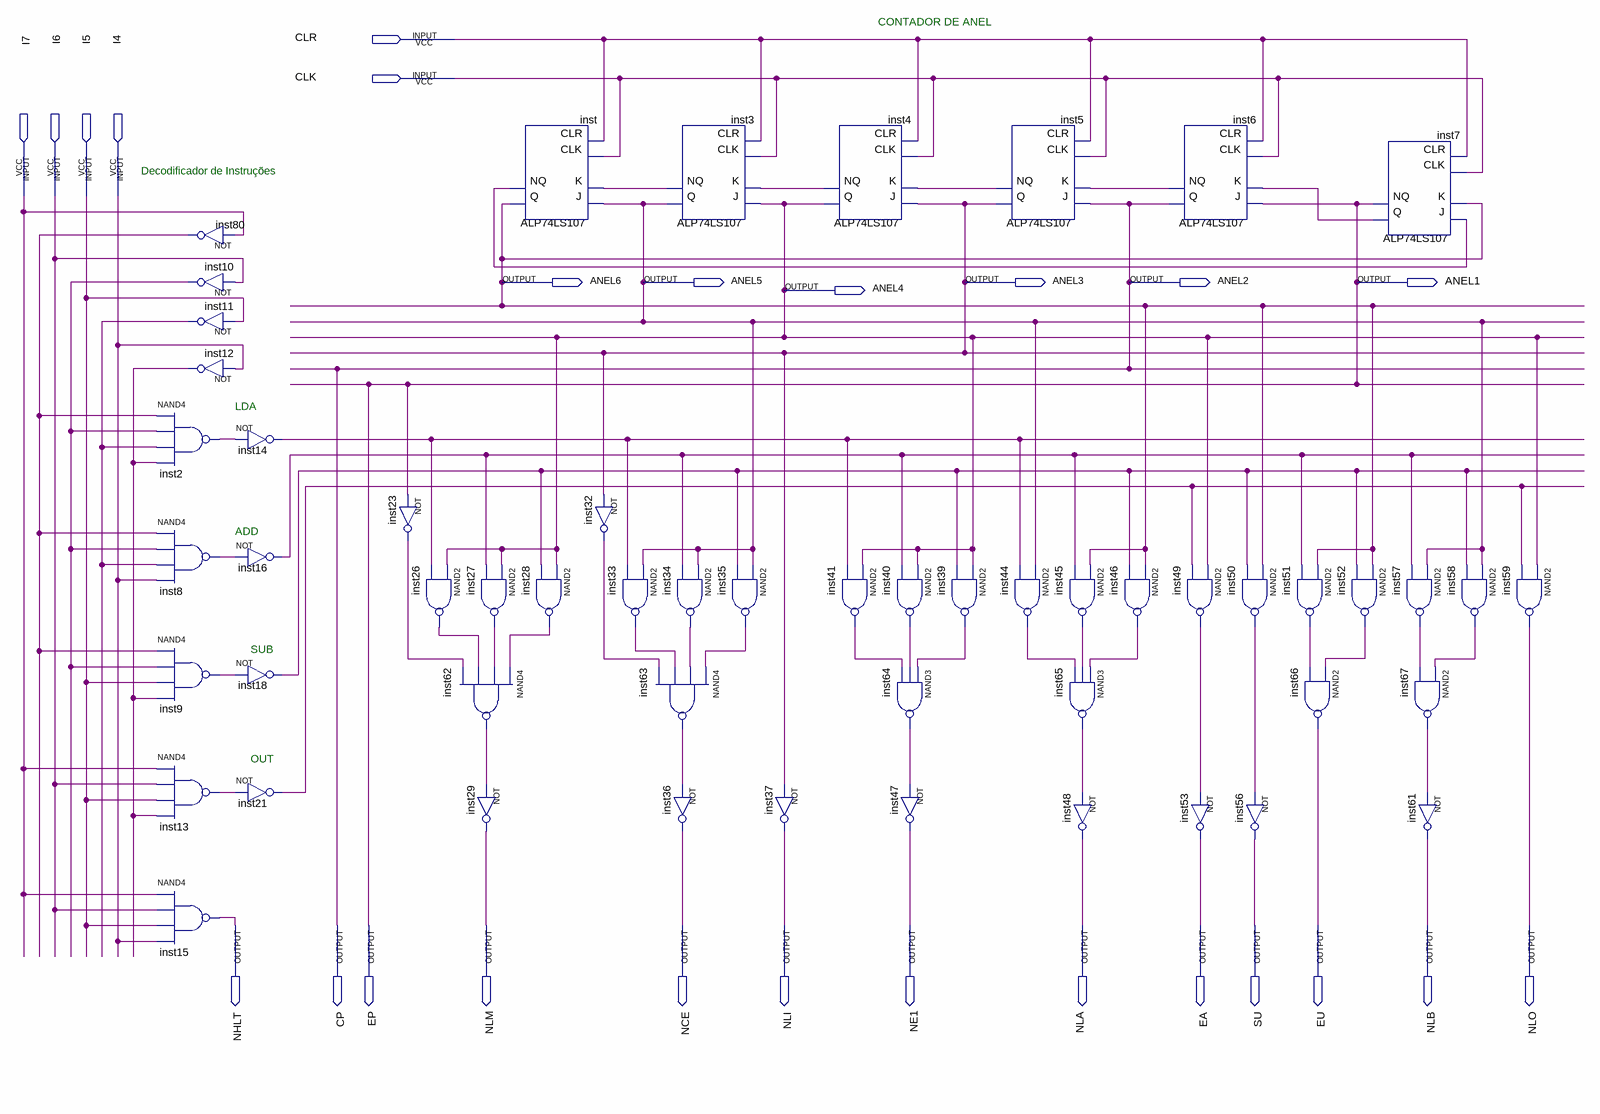
[diagram p0: schematic sheet]
// Quartus schematic ControladorSequencializador.bdf as structural Verilog: 54 symbols, 25 pins
module ControladorSequencializador (
  input  CLR,
  input  CLK,
  input  I7,
  input  I6,
  input  I5,
  input  I4,
  output ANEL6,
  output ANEL5,
  output ANEL3,
  output ANEL2,
  output ANEL1,
  output ANEL4,
  output NHLT,
  output CP,
  output EP,
  output NLM,
  output NCE,
  output NLI,
  output NE1,
  output NLA,
  output EA,
  output SU,
  output EU,
  output NLB,
  output NLO
);

  wire inst2_out, inst3_nq, inst4_nq, inst5_nq, inst6_nq, inst7_q, inst8_out, inst9_out, inst10_out,
       inst11_out, inst12_out, inst13_out, inst14_out, inst16_out, inst18_out, inst21_out, inst23_out,
       inst26_out, inst27_out, inst28_out, inst32_out, inst33_out, inst34_out, inst35_out, inst39_out,
       inst40_out, inst41_out, inst44_out, inst45_out, inst46_out, inst49_out, inst50_out, inst51_out,
       inst52_out, inst57_out, inst58_out, inst62_out, inst63_out, inst64_out, inst65_out, inst67_out,
       inst80_out, inst_nq;

  not inst80 (inst80_out, I7);
  not inst10 (inst10_out, I6);
  not inst11 (inst11_out, I5);
  not inst12 (inst12_out, I4);
  nand inst2 (inst2_out, inst80_out, inst10_out, inst11_out, inst12_out);
  nand inst8 (inst8_out, inst80_out, inst10_out, inst11_out, I4);
  nand inst9 (inst9_out, inst80_out, inst10_out, I5, inst12_out);
  nand inst13 (inst13_out, I7, I6, I5, inst12_out);
  nand inst15 (NHLT, I7, I6, I5, I4);
  not inst14 (inst14_out, inst2_out);
  not inst16 (inst16_out, inst8_out);
  not inst18 (inst18_out, inst9_out);
  not inst21 (inst21_out, inst13_out);
  not inst23 (inst23_out, ANEL1);
  nand inst26 (inst26_out, ANEL4, inst14_out);
  nand inst62 (inst62_out, inst28_out, inst27_out, inst26_out, inst23_out);
  ALP74LS107 inst (.J(ANEL5), .CLK(CLK), .K(inst3_nq), .CLR(CLR), .Q(ANEL6), .NQ(inst_nq));
  nand inst27 (inst27_out, ANEL4, inst16_out);
  not inst29 (NLM, inst62_out);
  nand inst28 (inst28_out, ANEL4, inst18_out);
  not inst32 (inst32_out, ANEL3);
  nand inst33 (inst33_out, ANEL5, inst14_out);
  ALP74LS107 inst3 (.J(ANEL4), .CLK(CLK), .K(inst4_nq), .CLR(CLR), .Q(ANEL5), .NQ(inst3_nq));
  nand inst34 (inst34_out, ANEL5, inst16_out);
  nand inst63 (inst63_out, inst35_out, inst34_out, inst33_out, inst32_out);
  not inst36 (NCE, inst63_out);
  nand inst35 (inst35_out, ANEL5, inst18_out);
  ALP74LS107 inst4 (.J(ANEL3), .CLK(CLK), .K(inst5_nq), .CLR(CLR), .Q(ANEL4), .NQ(inst4_nq));
  not inst37 (NLI, ANEL3);
  nand inst41 (inst41_out, ANEL4, inst14_out);
  nand inst40 (inst40_out, ANEL4, inst16_out);
  nand inst64 (inst64_out, inst39_out, inst40_out, inst41_out);
  nand inst39 (inst39_out, ANEL4, inst18_out);
  not inst47 (NE1, inst64_out);
  ALP74LS107 inst5 (.J(ANEL2), .CLK(CLK), .K(inst6_nq), .CLR(CLR), .Q(ANEL3), .NQ(inst5_nq));
  nand inst44 (inst44_out, ANEL5, inst14_out);
  nand inst45 (inst45_out, ANEL6, inst16_out);
  nand inst65 (inst65_out, inst46_out, inst45_out, inst44_out);
  not inst48 (NLA, inst65_out);
  nand inst46 (inst46_out, ANEL6, inst18_out);
  ALP74LS107 inst6 (.J(ANEL1), .CLK(CLK), .K(inst7_q), .CLR(CLR), .Q(ANEL2), .NQ(inst6_nq));
  nand inst49 (inst49_out, ANEL4, inst21_out);
  not inst53 (EA, inst49_out);
  nand inst50 (inst50_out, ANEL6, inst18_out);
  not inst56 (SU, inst50_out);
  nand inst51 (inst51_out, ANEL6, inst16_out);
  nand inst66 (EU, inst52_out, inst51_out);
  ALP74LS107 inst7 (.J(inst_nq), .CLK(CLK), .K(ANEL6), .CLR(CLR), .Q(inst7_q), .NQ(ANEL1));
  nand inst52 (inst52_out, ANEL6, inst18_out);
  nand inst57 (inst57_out, ANEL5, inst16_out);
  nand inst58 (inst58_out, ANEL5, inst18_out);
  nand inst67 (inst67_out, inst58_out, inst57_out);
  not inst61 (NLB, inst67_out);
  nand inst59 (NLO, ANEL4, inst21_out);

  assign CP = ANEL2;
  assign EP = ANEL1;

  // Notes on the sheet:
  //   CONTADOR DE ANEL
  //   Decodificador de Instruções
  //   LDA
  //   ADD
  //   SUB
  //   OUT
endmodule
